# Altium schematic sheet rocker.SchDoc
size A4; SheetNumber: 1; SheetTotal: 3; SPICEModelCacheVEPLIYUT: <root> / <DocumentId>VEPLIYUT</DocumentId> / </root>
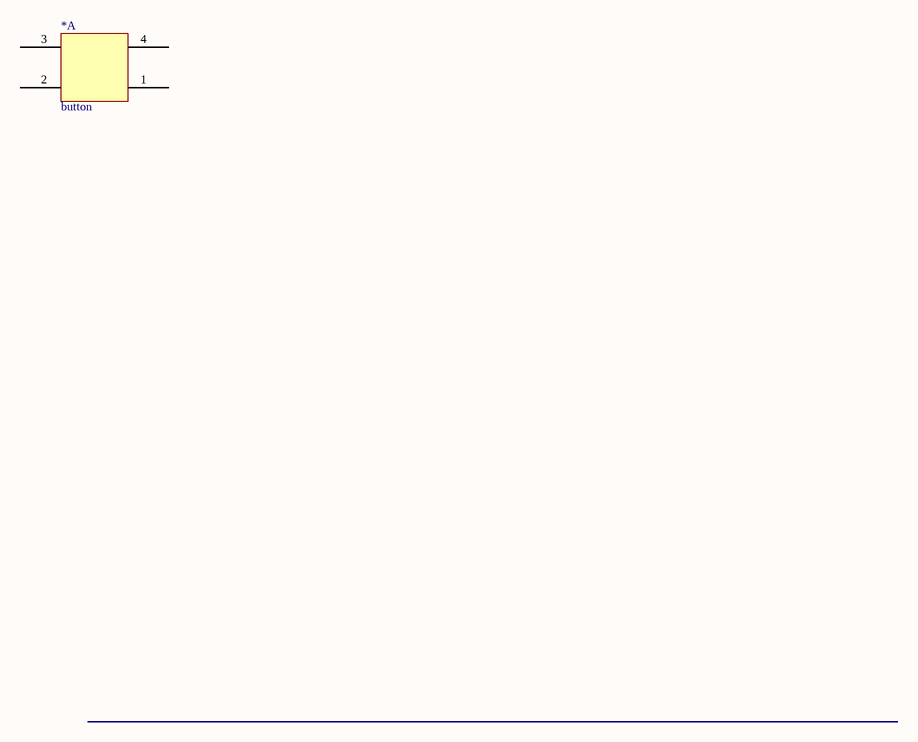
[diagram p0: rocker.SchDoc]

## Parts
*  button  (part A of 4)

## Nets

Not connected (* = marked no-connect by the designer): * 1 2 3 4